# EAGLE design base (EAGLE 6.4)
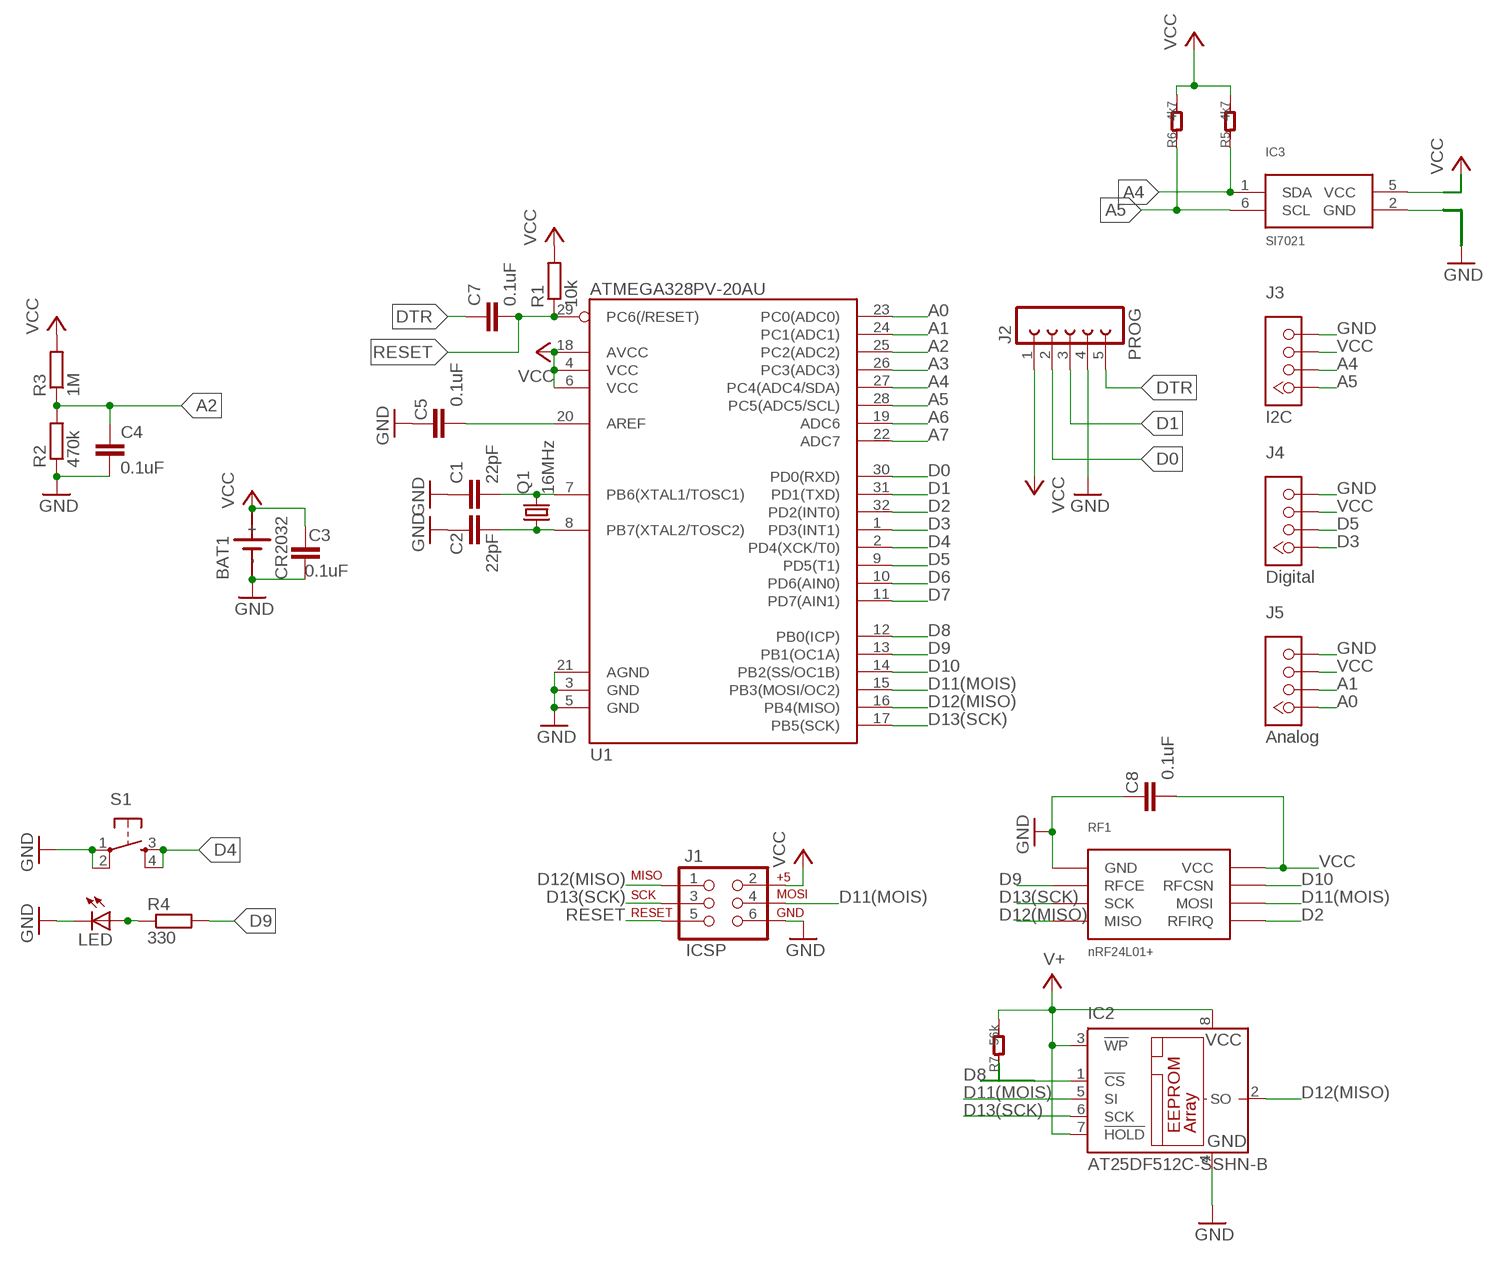
[diagram p0: schematic, sheet 1]

## Parts
BAT1  CR2032  SN2032  [SN2032]
C1  22pF  C-EUC0805  [C0805]
C2  22pF  C-EUC0805  [C0805]
C3  0.1uF  C-EUC0805  [C0805]
C4  0.1uF  C-EUC0805  [C0805]
C5  0.1uF  C-EUC0805  [C0805]
C7  0.1uF  C-EUC0805  [C0805]
C8  0.1uF  C-EUC0805  [C0805]
IC2  AT25DF512C-SSHN-B  25AA080SN  [SO-08]
IC3  SI7021  [DFN6]
J1  ICSP  AVR_SPI_PRG_6NS  [2X3-NS]
J3  I2C  TWIG-4P-2.0  [TWIG-4P-2.0]
J4  Digital  TWIG-4P-2.0  [TWIG-4P-2.0]
J5  Analog  TWIG-4P-2.0  [TWIG-4P-2.0]
LED  LEDCHIP-LED0805  [CHIP-LED0805]
PROG  J2  FE05-1  [FE05-1]
Q1  16MHz  CRYSTALCTS406  [CTS406]
R1  10k  R-EU_R0805  [R0805]
R2  470k  R-EU_R0805  [R0805]
R3  1M  R-EU_R0805  [R0805]
R4  330  R-EU_R0805  [R0805]
R5  4k7  R-0402  [R0402]
R6  4k7  R-0402  [R0402]
R7  56k  R-0402  [R0402]
RF1  nRF24L01+  NRF24L01  [2X4-2.54MM]
S1  TAC_SWITCHPTH  [TACTILE-PTH]
U1  ATMEGA328PV-20AU  ATMEGA328_SMT  [TQFP32-08]

## Nets
A0: J5.P$1 U1.23(PC0(ADC0))
A1: J5.P$2 U1.24(PC1(ADC1))
A2: C4.1 R2.2 R3.1 U1.25(PC2(ADC2))
A3: U1.26(PC3(ADC3))
A4: IC3.1(SDA) J3.P$2 R5.1 U1.27(PC4(ADC4/SDA))
A5: IC3.6(SCL) J3.P$1 R6.1 U1.28(PC5(ADC5/SCL))
A6: U1.19(ADC6)
A7: U1.22(ADC7)
D0: PROG.2 U1.30(PD0(RXD))
D1: PROG.3 U1.31(PD1(TXD))
D2: RF1.P$8(RFIRQ) U1.32(PD2(INT0))
D3: J4.P$1 U1.1(PD3(INT1))
D4: S1.3 S1.4 U1.2(PD4(XCK/T0))
D5: J4.P$2 U1.9(PD5(T1))
D6: U1.10(PD6(AIN0))
D7: U1.11(PD7(AIN1))
D8: IC2.1(!CS) U1.12(PB0(ICP))
D9: R4.2 RF1.P$3(RFCE) U1.13(PB1(OC1A))
D10: RF1.P$4(RFCSN) U1.14(PB2(SS/OC1B))
D11(MOIS): IC2.5(SI) J1.4 RF1.P$6(MOSI) U1.15(PB3(MOSI/OC2))
D12(MISO): IC2.2(SO) J1.1 RF1.P$7(MISO) U1.16(PB4(MISO))
D13(SCK): IC2.6(SCK) J1.3 RF1.P$5(SCK) U1.17(PB5(SCK))
DTR: C7.1 PROG.5
GND: BAT1.- C1.1 C2.1 C3.1 C4.2 C5.2 C8.2 IC2.4(GND) IC3.2(GND) J1.6 J3.P$4 J4.P$4 J5.P$4 LED.C PROG.4 R2.1 RF1.P$1(GND) S1.1 S1.2 U1.3(GND) U1.5(GND) U1.21(AGND)
N$1: C1.2 Q1.3 U1.7(PB6(XTAL1/TOSC1))
N$2: C2.2 Q1.1 U1.8(PB7(XTAL2/TOSC2))
N$5: C5.1 U1.20(AREF)
N$6: LED.A R4.1
RESET: C7.2 J1.5 R1.1 U1.29(PC6(/RESET))
VCC: BAT1.+ C3.2 C8.1 IC2.3(!WP) IC2.7(!HOLD) IC2.8(VCC) IC3.5(VCC) J1.2 J3.P$3 J4.P$3 J5.P$3 PROG.1 R1.2 R3.2 R5.2 R6.2 R7.2 RF1.P$2(VCC) U1.4(VCC) U1.6(VCC) U1.18(AVCC) ; supply symbol labelled V+
Unconnected: R7.1

## Library data of the parts
BAT1 = sn2032:SN2032: LI BATTERY
C1-C5 C7 C8 = rcl:C-EU: CAPACITOR, European symbol
IC2 = microchip:25*: Serial EEPROM 4K/ 8K , SPI bus; MF: MICROCHIP; MPN: 25AA080/SN; OC_FARNELL: 1816072; OC_NEWARK: 92C7351
IC3 = Sensor:SI7021
J1 = SparkFun-Connectors:AVR_SPI_PRG_6: AVR ISP 6 Pin This is the reduced ISP connector for AVR programming. Common on Arduino. This footprint will take up less PCB space and can be used with a 10-pin to 6-pin adapter such as SKU: BOB-08508
J3-J5 = matrix:TWIG-4P-2.0
LED = led:LED: LED OSRAM: - CHIPLED LG R971, LG N971, LY N971, LG Q971, LY Q971, LO R971, LY R971 LH N974, LH R974 LS Q976, LO Q976, LY Q976 LO Q996 - Hyper CHIPLED LW Q18S LB Q993, LB Q99A, LB R99A - SideLED LS A670, LO A670, LY A670, LG A670, LP A670 LB A673, LV A673, LT A673, LW A673 LH A674 LY A675 LS A676, LA A676, LO A676, LY A676, LW A676 LS A679, LY A679, LG A679 - Hyper Micro SIDELED® LS Y876, LA Y876, LO Y876, LY Y876 LT Y87S - SmartLED LW L88C, LW L88S LB L89C, LB L89S, LG L890 LS L89K, LO L89K, LY L89K LS L896, LA L896, LO L896, LY L896 - TOPLED LS T670, LO T670, LY T670, LG T670, LP T670 LSG T670, LSP T670, LSY T670, LOP T670, LYG T670 LG T671, LOG T671, LSG T671 LB T673, LV T673, LT T673, LW T673 LH T674 LS T676, LA T676, LO T676, LY T676, LB T676, LH T676, LSB T676, LW T676 LB T67C, LV T67C, LT T67C, LS T67K, LO T67K, LY T67K, LW E67C LS E67B, LA E67B, LO E67B, LY E67B, LB E67C, LV E67C, LT E67C LW T67C LS T679, LY T679, LG T679 LS T770, LO T770, LY T770, LG T770, LP T770 LB T773, LV T773, LT T773, LW T773 LH T774 LS E675, LA E675, LY E675, LS T675 LS T776, LA T776, LO T776, LY T776, LB T776 LHGB T686 LT T68C, LB T68C - Hyper Mini TOPLED® LB M676 - Mini TOPLED Santana® LG M470 LS M47K, LO M47K, LY M47K Source: http://www.osram.convergy.de LUXEON: - LUMILED® LXK2-PW12-R00, LXK2-PW12-S00, LXK2-PW14-U00, LXK2-PW14-V00 LXK2-PM12-R00, LXK2-PM12-S00, LXK2-PM14-U00 LXK2-PE12-Q00, LXK2-PE12-R00, LXK2-PE12-S00, LXK2-PE14-T00, LXK2-PE14-U00 LXK2-PB12-K00, LXK2-PB12-L00, LXK2-PB12-M00, LXK2-PB14-N00, LXK2-PB14-P00, LXK2-PB14-Q00 LXK2-PR12-L00, LXK2-PR12-M00, LXK2-PR14-Q00, LXK2-PR14-R00 LXK2-PD12-Q00, LXK2-PD12-R00, LXK2-PD12-S00 LXK2-PH12-R00, LXK2-PH12-S00 LXK2-PL12-P00, LXK2-PL12-Q00, LXK2-PL12-R00 Source: www.luxeon.com KINGBRIGHT: KA-3528ASYC Source: www.kingbright.com
PROG = con-lsta-my:FE05-1: FEMALE HEADER; OC_FARNELL: unknown; OC_NEWARK: unknown
Q1 = crystal:CRYSTAL: CRYSTAL; OC_FARNELL: unknown; OC_NEWARK: unknown
R1-R4 = rcl:R-EU_: RESISTOR, European symbol
R5-R7 = Discrete:R*
RF1 = matrix:NRF24L01
S1 = SparkFun-Electromechanical:TAC_SWITCH: Momentary Switch Button commonly used for reset or general input. Spark Fun Electronics SKU : COM-00097 SMT- SWCH-08247
U1 = SparkFun-DigitalIC:ATMEGA328_SMT: 32-Pin Atmega328 part Commonly used on Arduino compatible boards Available in QFP and QFN packages TQFP is IC-09069 QFN is non-stock; PROD_ID: IC-09069; VALUE: ATMEGA328P

## Net classes
0 default: width 0.203 mm
1 Power: width 0.406 mm

## Board
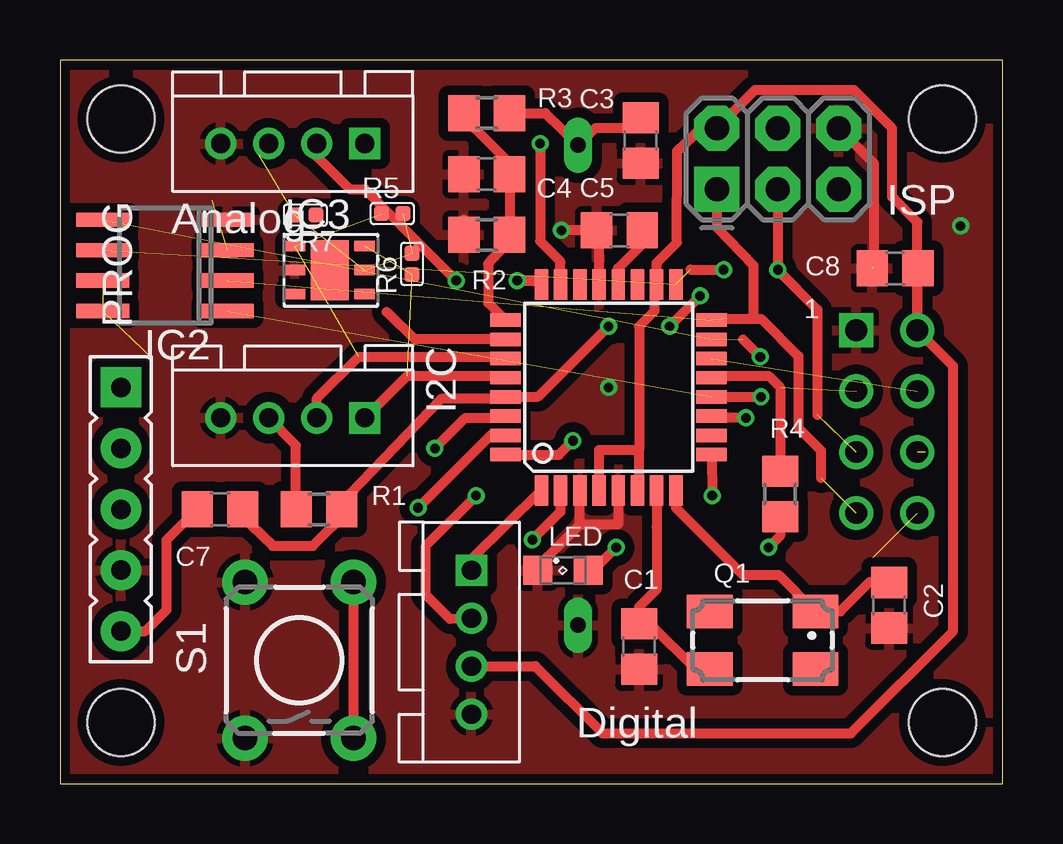
[diagram p1: board, top side]
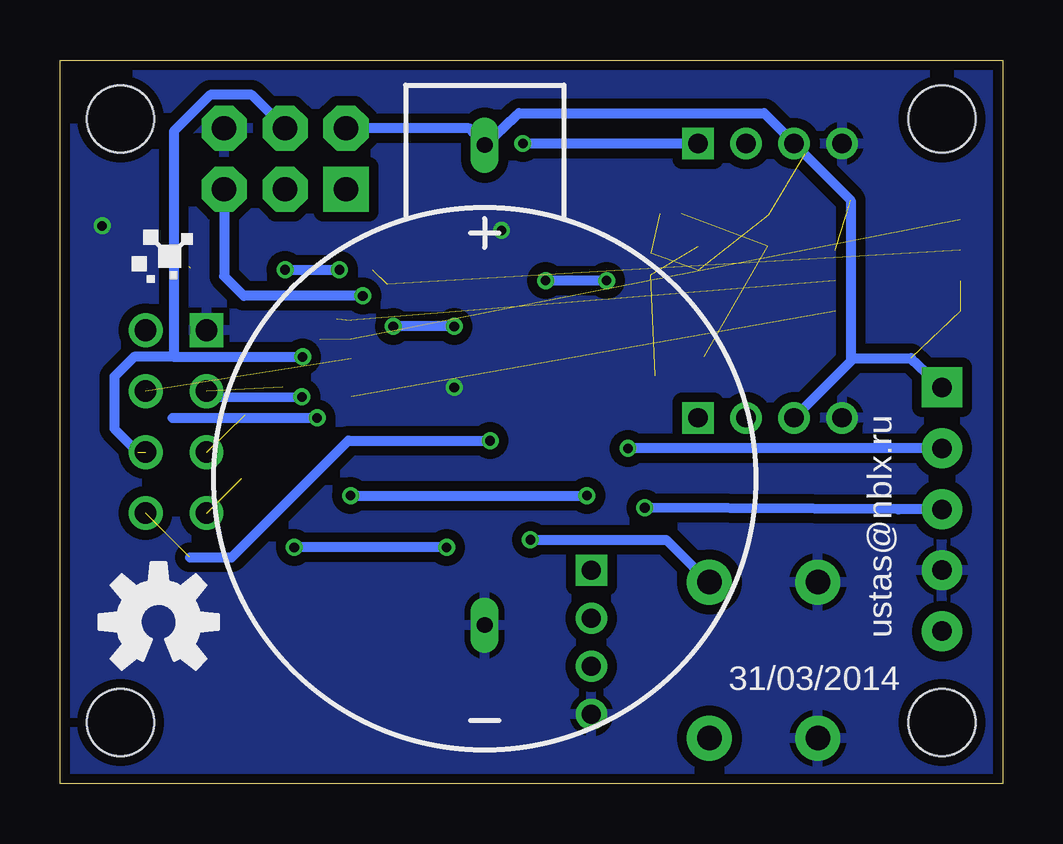
[diagram p2: board, bottom side, seen from below]

Size 39.29 x 30.15 mm. Coordinates in mm from the lower left corner, seen from the top.
Outline: 0,0 39.29,0 39.29,30.15 0,30.15 0,0
Copper layers (1*16): Top 0.035mm / dielectric 1.5mm / Bottom 0.035mm
Design rules "default": minimum track width 6mil, minimum drill 12mil, track to track 6mil, track to pad 6mil, pad to pad 6mil, via to via 6mil, smd to smd 0mil, copper to edge 10mil, drill to drill 10mil, minimum pad ring 10mil, minimum via ring 6mil, stop-mask expansion 2mil, vias tented up to drill 100mil, thermal gap 10mil
Holes 2.8 mm at 2.54,2.54 36.77,2.54 2.54,27.69 36.77,27.69

### Footprints (pad centres in the part's own frame; a part is rotated, then mirrored left to right if it is on the bottom)
SN2032 = drill 0.65 long: + 0,13.9; - 0,-6.1
C0805 = smd 1.3 x 1.5: 1 -0.95,0; 2 0.95,0
SO-08 = smd 0.6 x 2.2: 1 -1.905,-2.6; 2 -0.635,-2.6; 3 0.635,-2.6; 4 1.905,-2.6; 5 1.905,2.6; 6 0.635,2.6; 7 -0.635,2.6; 8 -1.905,2.6
DFN6 = smd 0.85 x 0.45: 1 -1.45,1; 2 -1.45,0; 3 -1.45,-1; 4 1.45,-1; 5 1.45,0; 6 1.45,1 | smd 1.6 x 2.5: P$1 0,0
2X3-NS@1 = drill 1.016 pad 1.88 square: 1 -2.54,-1.27 | drill 1.016 pad 1.88 octagon: 2 -2.54,1.27; 3 0,-1.27; 4 0,1.27; 5 2.54,-1.27; 6 2.54,1.27
TWIG-4P-2.0 = drill 0.8 square: P$1 0,0 | drill 0.8: P$2 0,2; P$3 0,4; P$4 0,6
SML0805 = smd 1.2 x 1.2: A 1.05,0; C -1.05,0
FE05-1 = drill 0.813 pad 1.676 square: 1 -5.08,0 | drill 0.813 pad 1.676: 2 -2.54,0; 3 0,0; 4 2.54,0; 5 5.08,0
CTS406 = smd 1.9 x 1.4: 1 -2.2,-1.2; 2 2.2,-1.2; 3 2.2,1.2; 4 -2.2,1.2
R0805 = smd 1.3 x 1.5: 1 -0.95,0; 2 0.95,0
R0402 = smd 0.635 x 0.635: 1 0,0.445; 2 0,-0.445
2X4-2.54MM = drill 0.9 square: P$1 0,0 | drill 0.9: P$2 2.54,0; P$3 0,-2.54; P$4 2.54,-2.54; P$5 0,-5.08; P$6 2.54,-5.08; P$7 0,-7.62; P$8 2.54,-7.62
TACTILE-PTH = drill 1.016 pad 1.88: 1 -3.251,2.261; 2 3.251,2.261; 3 -3.251,-2.261; 4 3.251,-2.261
TQFP32-08 = smd 1.27 x 0.559: 1 -4.293,2.8; 2 -4.293,2; 3 -4.293,1.2; 4 -4.293,0.4; 5 -4.293,-0.4; 6 -4.293,-1.2; 7 -4.293,-2; 8 -4.293,-2.8; 17 4.293,-2.8; 18 4.293,-2; 19 4.293,-1.2; 20 4.293,-0.4; 21 4.293,0.4; 22 4.293,1.2; 23 4.293,2; 24 4.293,2.8 | smd 0.559 x 1.27: 9 -2.8,-4.293; 10 -2,-4.293; 11 -1.2,-4.293; 12 -0.4,-4.293; 13 0.4,-4.293; 14 1.2,-4.293; 15 2,-4.293; 16 2.8,-4.293; 25 2.8,4.293; 26 2,4.293; 27 1.2,4.293; 28 0.4,4.293; 29 -0.4,4.293; 30 -1.2,4.293; 31 -2,4.293; 32 -2.8,4.293

### Placement (x,y rotation side)
BAT1  21.59,12.7 0 bottom
C1  24.13,5.71 90 top
C2  34.54,7.43 90 top
C3  24.19,26.8 90 top
C4  17.78,25.4 180 top
C5  23.3,23.05 180 top
C7  6.67,11.43 0 top
C8  34.8,21.46 180 top
E$1  [OSHW-LOGO-M]  35.18,6.73 0 bottom
IC2  4.38,21.59 90 top
IC3  11.24,21.4 0 top
J1  ICSP  [2X3-NS@1]  29.91,26.04 0 top
J3  12.7,15.24 90 top
J4  17.14,8.89 180 top
J5  12.7,26.67 90 top
LED  [SML0805]  20.95,8.89 0 top
PROG  2.54,11.43 270 top
Q1  29.27,5.97 180 top
R1  10.79,11.43 180 top
R2  17.78,22.86 0 top
R3  17.78,27.94 0 top
R4  30,12.06 90 top
R5  13.84,23.75 90 top
R6  14.67,21.65 180 top
R7  10.22,23.69 270 top
RF1  33.18,18.89 0 top
S1  9.97,5.14 90 top
U1  22.86,16.51 90 top

### Tracks (layer width: path | path; a pad name or v marks a point on that pad's centre or on a via)
A0  (via drill 0.4)
  Top 0.406: v20,26.67 20,22.61 20.83,21.78 20.85,21.71 U1.23
  Bottom 0.406: J5.P$1 v20,26.67
A1  (via drill 0.4)
  Top 0.406: J5.P$2 10.69,26.14 12.06,24.77 12.7,24.77 v16.51,20.96 | v19.05,20.96 19.68,20.96 U1.24
  Bottom 0.406: v16.51,20.96 v19.05,20.96
A2
  Top 0.254: C4.1 18.73,22.92 | R2.2 18.99,22.92
  Top 0.406: U1.25 17.84,20.03 17.84,21.65 18.48,22.35 18.99,22.92 18.73,22.92 18.73,25.84 17.27,27.3 17.27,27.94 R3.1
A3
  Top 0.406: U1.26 18.11,18.52 14.78,18.52 13.61,19.66
A4  (2 unrouted)
  Top 0.406: J3.P$2 10.71,16.05 12.45,17.78 17.91,17.78 U1.27
A5  (2 unrouted)
  Top 0.406: J3.P$1 13.08,15.59 14.48,16.99 17.89,16.99 U1.28
D0  (via drill 0.4)
  Top 0.406: v15.62,13.97 16.89,15.24 18.09,15.24 U1.30
  Bottom 0.406: PROG.2 v15.62,13.97
D1  (via drill 0.4)
  Top 0.406: v14.92,11.49 17.95,14.52 U1.31
  Bottom 0.406: v14.92,11.49 4.35,11.43 PROG.3
D2  (via drill 0.4)  (1 unrouted)
  Top 0.406: v21.37,14.29 20.78,13.7 U1.32 18.54,13.71
  Bottom 0.406: v21.37,14.29 27.27,14.29 32.13,9.43 33.88,9.43
D3
  Top 0.406: J4.P$1 17.14,9.33 17.18,9.4 U1.1
D4  (via drill 0.4)
  Top 0.406: S1.3 S1.4 | U1.2 20.85,11.32 v19.68,10.16
  Bottom 0.406: v19.68,10.16 14.03,10.16 12.47,8.6 S1.4
D5  (via drill 0.4)
  Top 0.406: U1.9 v27.18,12 | v17.34,12 15.24,9.91 15.24,7.87 16.26,6.86 J4.P$2
  Bottom 0.406: v27.18,12 v17.34,12
D7  (via drill 0.4)
  Top 0.406: v28.57,15.24 27.78,15.25 U1.11
  Bottom 0.406: 34.61,15.24 v28.57,15.24
D8  (via drill 0.4)  (1 unrouted)
  Top 0.406: U1.12 v29.21,16.11
  Bottom 0.406: 32.96,16.11 v29.21,16.11
D9  (1 unrouted)
  Top 0.406: U1.13 27.77,16.99 29.53,16.99 30,16.51 R4.2 30.16,12.86
D10  (1 unrouted)
D11(MOIS)  (via drill 0.4)  (3 unrouted)
  Top 0.406: 28.47,18.5 v29.18,17.78
  Bottom 0.406: 34.54,17.78 36.2,17.78 37.02,16.96 37.02,14.79 36.05,13.81 | J1.4 31.3,28.7 33.02,28.7 34.54,27.18 34.54,17.78 | 34.54,17.78 v29.18,17.78
D12(MISO)  (3 unrouted)
  Top 0.406: 27.76,19.37 28.7,19.37 | 28.7,19.37 29.21,19.37 30.77,17.81 30.77,14.83 31.72,13.87 31.72,12.73 | J1.1 27.37,23.18 28.89,21.59 28.89,19.37 28.89,19.43 28.7,19.37
D13(SCK)  (via drill 0.4)  (3 unrouted)
  Top 0.406: v29.91,21.41 31.56,19.75 | 31.56,19.75 31.56,15.37 | 26.27,21.41 v27.65,21.41 | J1.3 29.91,21.4 31.56,19.75
  Bottom 0.406: v29.91,21.41 v27.65,21.41
DTR
  Top 0.254: C7.1
  Top 0.406: PROG.5 3.56,6.35 4.45,7.24 4.45,10.16 C7.1
GND  (via drill 0.4)  (1 unrouted)
  Top 0.254: LED.C 20.32,8.89
  Top 0.406: R2.1 16.83,23.5 | U1.21 22.48,20.8 22.48,22.61 22.35,22.61 C5.2 v20.89,23.05 | 20.32,8.89 20.32,9.46 21.65,10.79 | 21.65,10.79 U1.3 | U1.5 23.26,10.81 23.24,10.79 21.65,10.79 | J1.6 33.91,25.84 33.91,21.53
  other vias: 37.53,23.24 22.86,16.51
  pour Top (isolate 0.406): -1.27,31.11 41.27,31.11 41.27,-1.27 -1.27,-1.27
  pour Bottom (isolate 0.406): -1.27,31.11 41.27,31.11 41.27,-1.27 -1.27,-1.27
N$1
  Top 0.406: U1.7 24.86,10.7 24.86,8.1 24.13,7.37 C1.2 24.58,6.66 26.48,4.76 Q1.3 | 27.18,4.76 Q1.3 | Q1.3
N$2
  Top 0.406: 31.54,7.24 Q1.1 | U1.8 25.66,11.49 28.45,8.7 29.94,8.7 Q1.1 | C2.2 33.72,8.38 32.51,7.18 31.69,7.18 31.62,7.11 31.5,7.24 31.5,7.19 Q1.1
N$5
  Top 0.406: U1.20 23.26,21.48 24.26,22.48 C5.1
N$6  (via drill 0.4)
  Top 0.406: LED.A 22.23,8.89 v23.18,9.84 | R4.1 30,10.32 v29.53,9.84
  Bottom 0.406: v23.18,9.84 v29.53,9.84
RESET  (via drill 0.4)
  Top 0.254: C7.2 7.94,11.43 | R1.1 12.06,11.43
  Top 0.406: v22.86,19.05 19.92,16.12 U1.29 17.94,16.03 15.88,16.03 12.06,12.06 12.06,11.43 10.54,9.91 8.86,9.91 7.94,10.79 7.94,11.43 | v25.4,19.05 v26.67,20.32
  Bottom 0.406: v22.86,19.05 v25.4,19.05 | v26.67,20.32 31.62,20.32 32.45,21.15 J1.5
VCC  (7 unrouted)
  Top 0.254: R1.2 9.53,11.43 | U1.18 24.77,20.32 | U1.6 24.13,12.7
  Top 0.406: U1.18 24.86,21.7 24.89,21.72 25.71,22.54 25.72,26.35 26.73,27.3 J1.2 28.96,28.89 33.08,28.89 34.67,27.3 34.67,24.45 35.72,23.4 RF1.P$2 | 9.53,11.43 9.83,11.15 9.83,14.09 J3.P$3 | 24.77,20.32 24.77,19.69 24.13,19.05 24.13,13.91 | 24.13,12.7 24.13,13.91 | U1.4 22.46,13.91 24.13,13.91 | R3.2 20.23,27.94 BAT1.+ 22.3,27.3 24.19,27.3 C3.2 | J4.P$3 19.81,4.89 22.61,2.1 32.96,2.1 37.21,6.35 37.21,17.4 RF1.P$2 | 24.13,12.15 U1.6 | RF1.P$2 35.75,18.98 C8.1
  Bottom 0.406: J1.2 22.23,27.3 BAT1.+ 20.31,27.81 20.16,27.94 9.95,27.94 9.15,27.15 J5.P$3 8.26,26.21 6.34,24.3 6.34,17.6 | PROG.1 3.83,17.73 6.21,17.73 6.34,17.6 | J3.P$3 6.34,17.6

### Text on the board
tNames: ISP | Analog | 1 | I2C | S1 | Digital
bNames: ustas@nblx.ru | 31/03/2014